# EasyEDA Pro project ProPrj_IoT House_2026-04-28.epro, board PCB3_2
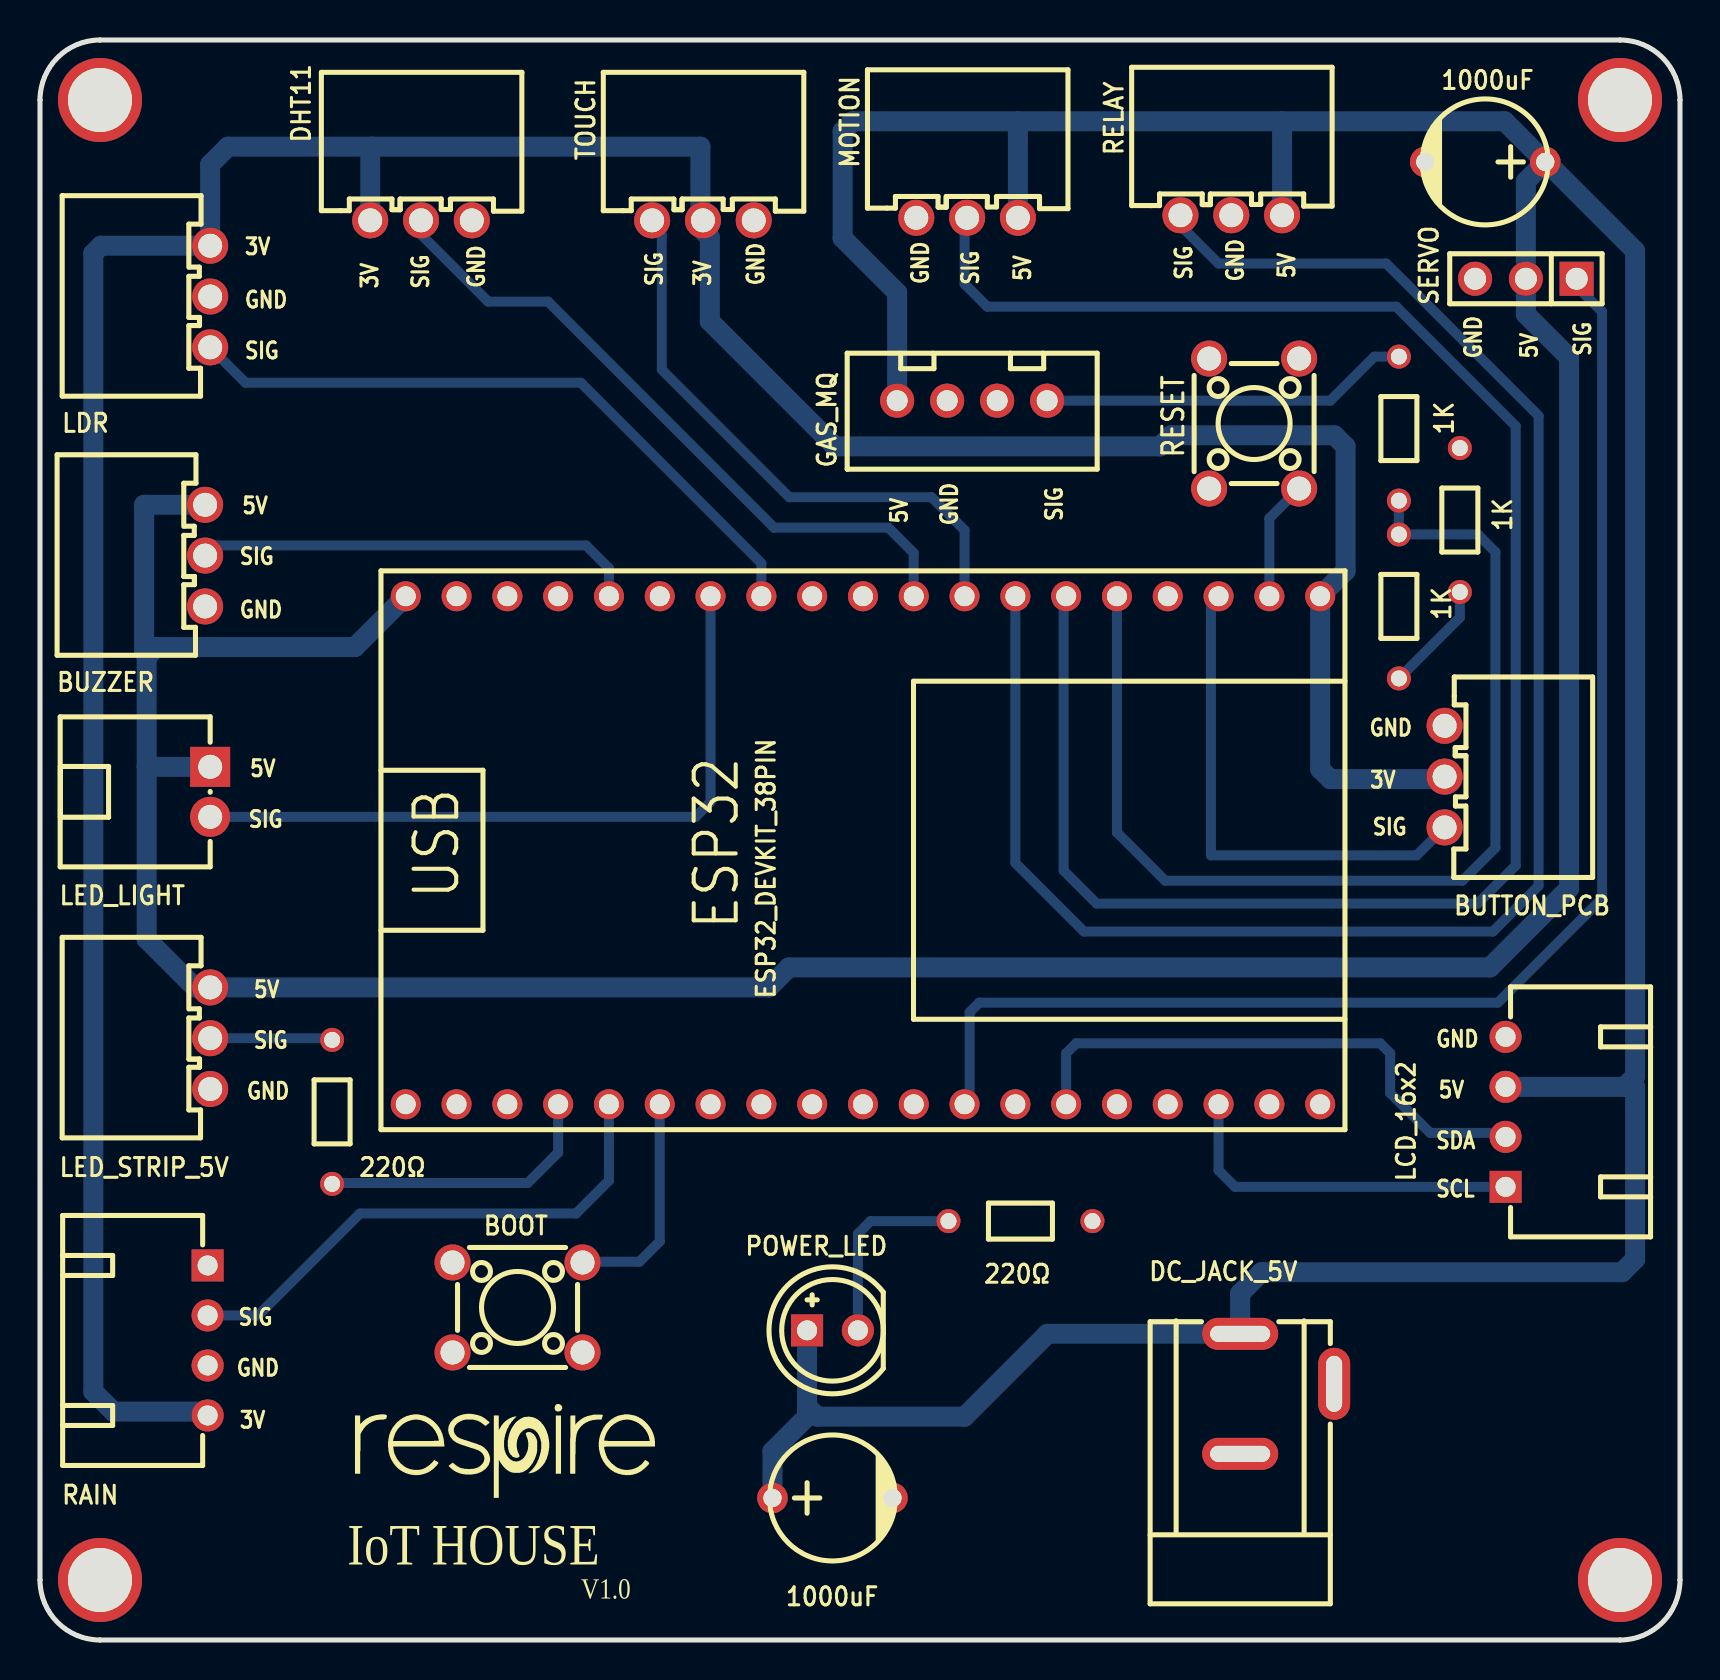
[diagram p9: board, top side]
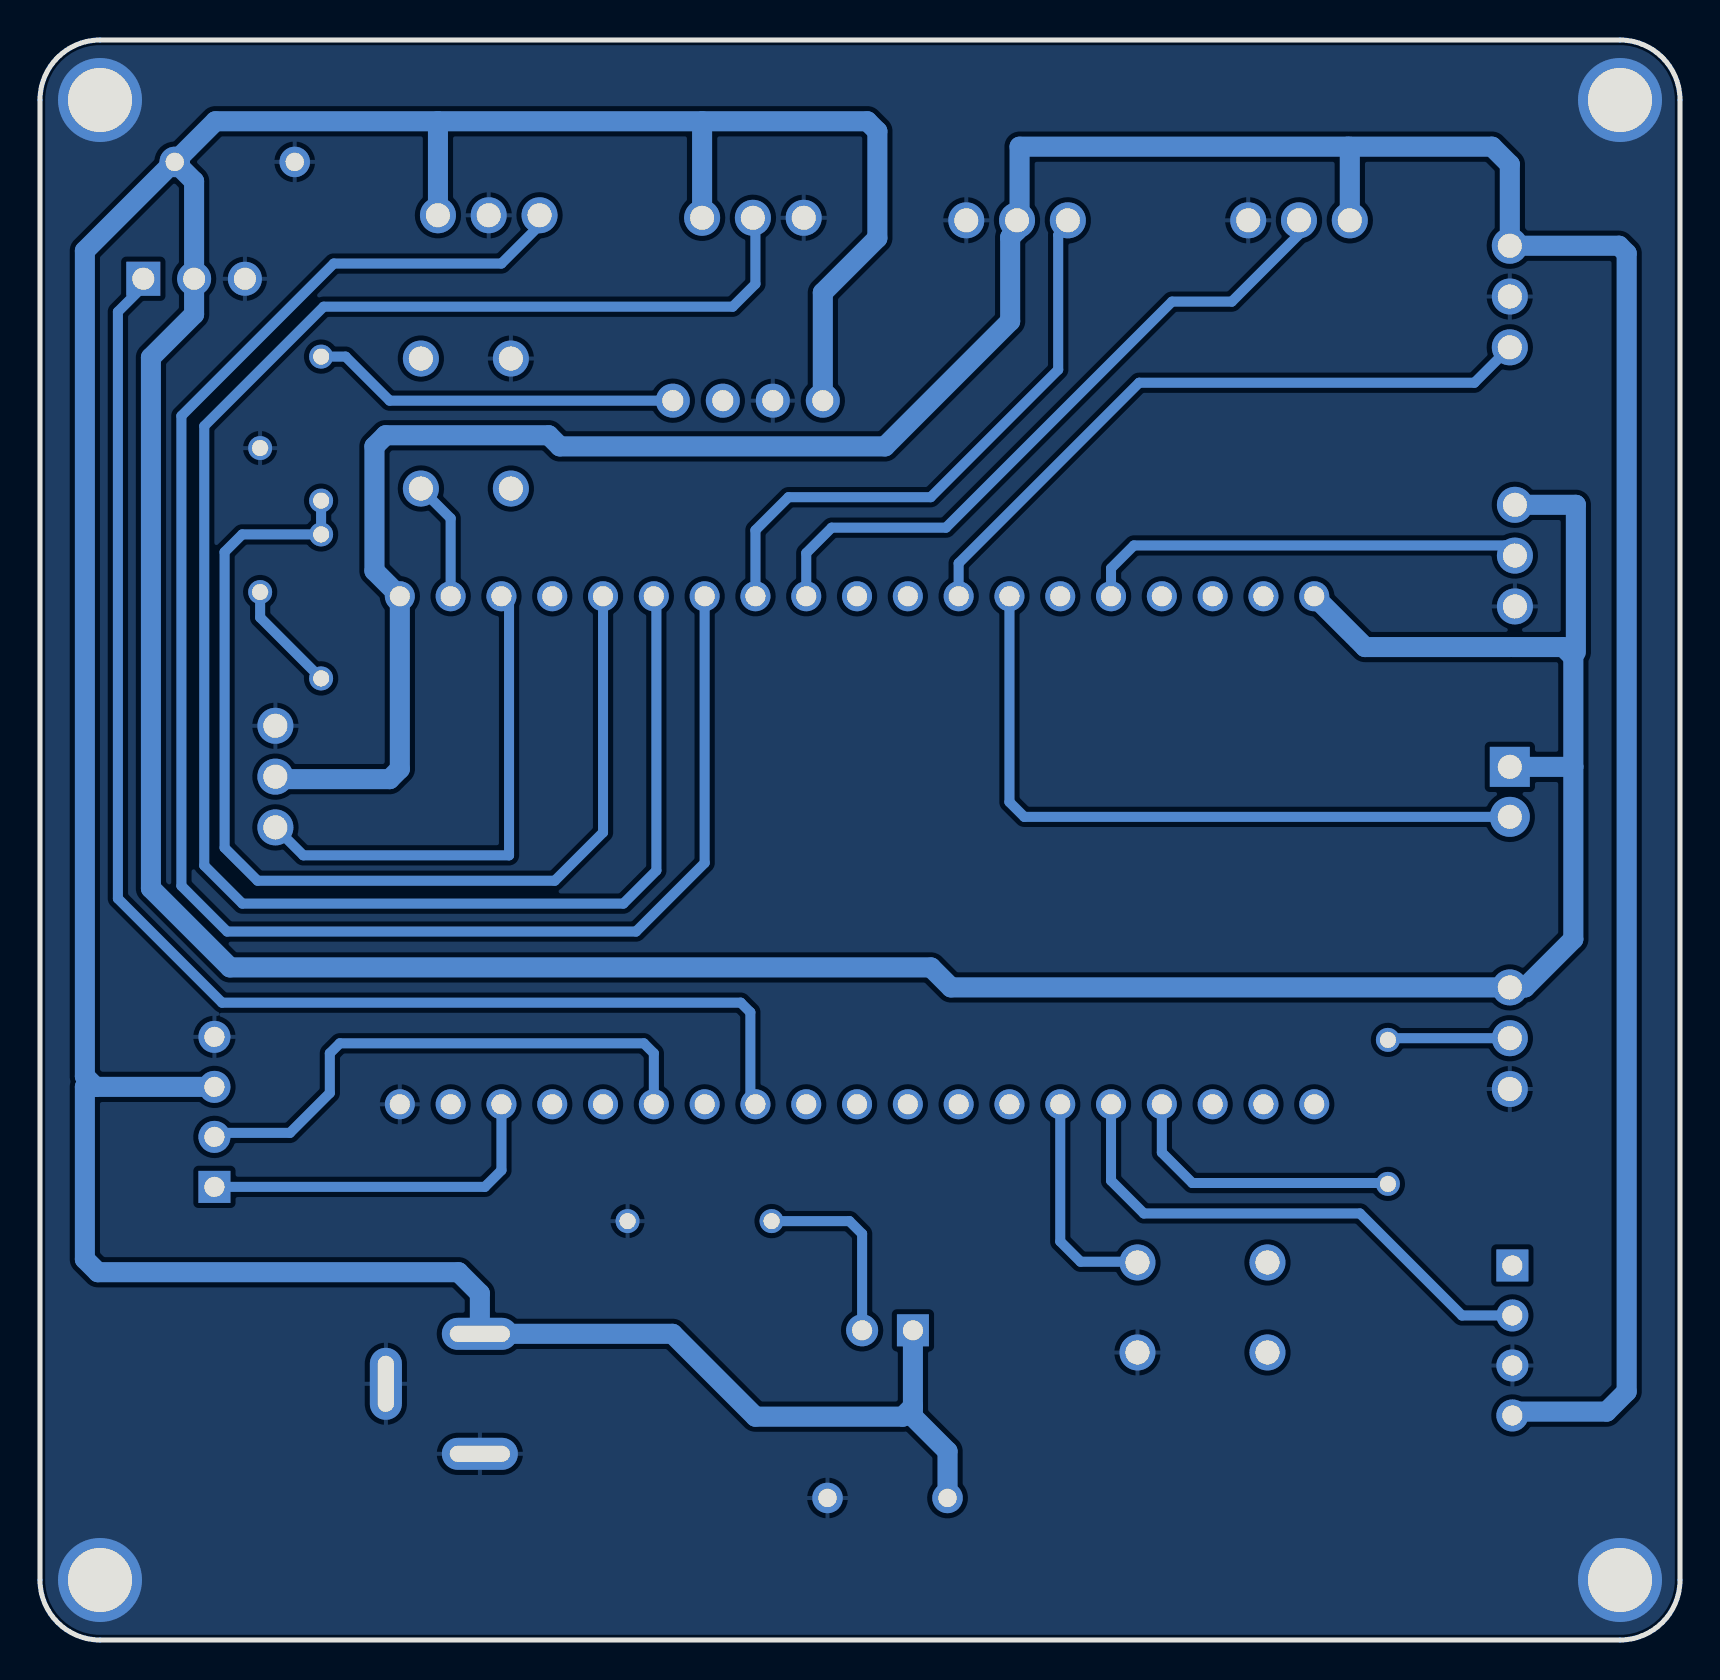
[diagram p10: board, bottom side, seen from below]

Outline 82 x 80 mm; copper layers: Top Layer, Bottom Layer. Coordinates in mm from the lower left corner of the outline.
Outline path: 0,77 0,3 arc(0.88,0.88) 3,0 79,0 arc(81.12,0.88) 82,3 82,77 arc(81.12,79.12) 79,80 3,80 arc(0.88,79.12) 0,77
Stack: Top Layer 0.035mm / Dielectric1 1.51mm FR4 er 4.5 / Bottom Layer 0.035mm

## Design rules (mm)
template: JLCPCB Capability(Two Layers Board)
spacing copperThickness1oz (default): track to track 0.102, other pairs 0.152 to 0.3
spacing copperThickness2oz: track to track 0.203, other pairs 0.152 to 0.3
track width copperThickness1oz (default): min 0.127, default 0.254, max 2.54
track width copperThickness2oz: min 0.203, default 0.254, max 2.54
differential pair differentialPair (default): width min 0.127, default 0.254, max 2.54; gap min 0.152, default 0.152
via viaSize (default): diameter min 0.5, default 0.61, max 10; hole min 0.3, default 0.305, max 6.3

## Placement (name value [footprint] x y rotation side)
1K  1K  [RES-TH_BD1.8-L3.2-P7.20-D0.4]  67.94 51.68 90 top
1K#2  -  [RES-TH_BD1.8-L3.2-P7.20-D0.4]  70.99 56 270 top
1K#3  -  [RES-TH_BD1.8-L3.2-P7.20-D0.4]  67.94 60.57 90 top
220Ω  220  [RES-TH_BD1.8-L3.2-P7.20-D0.4]  49.02 20.94 0 top
220Ω#2  -  [RES-TH_BD1.8-L3.2-P7.20-D0.4]  14.61 26.41 270 top
1000uF  470uF  [CAP-TH_BD6.3-P6.00-D0.8-FD]  39.62 7.1 0 top
1000uF#2  -  [CAP-TH_BD6.3-P6.00-D0.8-FD]  72.26 73.9 180 top
BOOT  AJ1-6*6_A  [SW-TH_4P-L6.0-W6.0-P4.50-LS6.5]  23.88 16.63 180 top
BUTTON_PCB  XH-3AW  [CONN-TH_3P-P2.54_HCTL_XH-3AW]  70.23 43.17 270 top
BUZZER  XH-3AW  [CONN-TH_3P-P2.54_HCTL_XH-3AW]  8.25 54.22 90 top
DC_JACK_5V  DC-005-5.5*2.1  [DC-IN-TH_DC-005-2]  62.36 12.31 90 top
DHT11  XH-3AW  [CONN-TH_3P-P2.54_HCTL_XH-3AW]  19.05 70.98 0 top
ESP32_DEVKIT_38PIN  ESP32-DevKitC  [BULETM-SMD_ESP32-DEVKITC]  41.15 39.49 180 top
GAS_MQ  XH-4A-2.54  [CONN-TH_4P-P2.50-XH2.54-4P]  46.61 61.97 0 top
LCD_16x2  XH-4AW  [CONN-TH_4P-P2.50_XH-4AW]  73.28 26.41 270 top
LDR  XH-3AW  [CONN-TH_3P-P2.54_HCTL_XH-3AW]  8.51 67.17 90 top
LED_LIGHT  XH-2AW  [CONN-TH_XH-2AW_C722860]  8.51 42.41 270 top
LED_STRIP_5V  XH-3AW  [CONN-TH_3P-P2.54_HCTL_XH-3AW]  8.51 30.09 90 top
MOTION  XH-3AW  [CONN-TH_3P-P2.54_HCTL_XH-3AW]  46.35 71.11 0 top
NOREF  -  [Pad_e903]  3 77 0 top
NOREF#2  -  [Pad_e625]  79 3 0 top
NOREF#3  -  [Pad_e978]  3 3 0 top
NOREF#4  -  [Pad_e831]  79 77 0 top
POWER_LED  -  [LED-TH_BD5.8-P2.54-FD]  39.62 15.48 0 top
RAIN  XH-4AW  [CONN-TH_4P-P2.50_XH-4AW]  8.38 14.98 90 top
RELAY  XH-3AW  [CONN-TH_3P-P2.54_HCTL_XH-3AW]  59.56 71.24 0 top
RESET  AJ1-6*6_A  [SW-TH_4P-L6.0-W6.0-P4.50-LS6.5]  60.71 60.82 90 top
SERVO  -  [HDR-TH_3P-P2.54-V-M]  74.29 68.06 180 top
TOUCH  XH-3AW  [CONN-TH_3P-P2.54_HCTL_XH-3AW]  33.15 70.98 0 top

## Footprints (pads in the part's own frame, mm; a bottom-side part is the same pattern mirrored in y, then rotated)
BULETM-SMD_ESP32-DEVKITC
  round 1.5 hole 1: 1(-22.86,-12.7) 2(-20.32,-12.7) 3(-17.78,-12.7) 4(-15.24,-12.7) 5(-12.7,-12.7) 6(-10.16,-12.7) 7(-7.62,-12.7) 8(-5.08,-12.7) 9(-2.54,-12.7) 10(0,-12.7) 11(2.54,-12.7) 12(5.08,-12.7) 13(7.62,-12.7) 14(10.16,-12.7) 15(12.7,-12.7) 16(15.24,-12.7) 17(17.78,-12.7) 18(20.32,-12.7) 19(22.86,-12.7) 20(-22.86,12.7) 21(-20.32,12.7) 22(-17.78,12.7) 23(-15.24,12.7) 24(-12.7,12.7) 25(-10.16,12.7) 26(-7.62,12.7) 27(-5.08,12.7) 28(-2.54,12.7) 29(0,12.7) 30(2.54,12.7) 31(5.08,12.7) 32(7.62,12.7) 33(10.16,12.7) 34(12.7,12.7) 35(15.24,12.7) 36(17.78,12.7) 37(20.32,12.7) 38(22.86,12.7)
CAP-TH_BD6.3-P6.00-D0.8-FD
  round 1.524 hole 0.914: 1(-3,0) 2(3,0)
CONN-TH_3P-P2.54_HCTL_XH-3AW
  round 1.8 hole 1.199: 1(-2.54,0) 2(0.002,0) 3(2.54,0)
CONN-TH_4P-P2.50-XH2.54-4P
  round 1.7 hole 1.05: 1(3.75,0) 2(1.25,0) 3(-1.25,0) 4(-3.75,0)
CONN-TH_4P-P2.50_XH-4AW
  rect 1.6x1.6 hole 1: 1(3.75,0)
  round 1.6 hole 1: 2(1.25,0) 3(-1.25,0) 4(-3.75,0)
CONN-TH_XH-2AW_C722860
  rect 2x2 hole 1.2: 1(-1.25,0)
  round 2 hole 1.2: 2(1.25,0)
DC-IN-TH_DC-005-2
  oval 1.6x3.8 hole 0.8x3: 1(2.999,2.35) 2(-3,2.35)
  oval 3.6x1.6 hole 2.8x0.8: 3(0.5,-2.35)
HDR-TH_3P-P2.54-V-M
  rect 1.7x1.7 hole 1.1: 1(-2.54,0)
  round 1.7 hole 1.1: 2(0,0) 3(2.54,0)
LED-TH_BD5.8-P2.54-FD
  rect 1.6x1.6 hole 1: 1(-1.27,0)
  round 1.6 hole 1: 2(1.27,0)
Pad_e625
  round 4.2 hole 3.2: 1(0,0)
Pad_e831
  round 4.2 hole 3.2: 1(0,0)
Pad_e903
  round 4.2 hole 3.2: 1(0,0)
Pad_e978
  round 4.2 hole 3.2: 1(0,0)
RES-TH_BD1.8-L3.2-P7.20-D0.4
  round 1.2 hole 0.8: 1(-3.6,0) 2(3.6,0)
SW-TH_4P-L6.0-W6.0-P4.50-LS6.5
  round 1.8 hole 1.2: 1(-3.25,2.25) 2(3.25,2.25) 3(-3.25,-2.25) 4(3.25,-2.25)

## Nets
3V: BUTTON_PCB.2 DHT11.1 ESP32_DEVKIT_38PIN.1 LDR.3 RAIN.4 TOUCH.2
5V: 1000uF.1 1000uF#2.1 BUZZER.3 DC_JACK_5V.1 ESP32_DEVKIT_38PIN.19 GAS_MQ.4 LCD_16x2.3 LED_LIGHT.1 LED_STRIP_5V.3 MOTION.3 POWER_LED.1 RELAY.3 SERVO.2
GND: 1K#2.1 220Ω.2 1000uF.2 1000uF#2.2 BOOT.1 BUTTON_PCB.1 BUZZER.1 DC_JACK_5V.2 DC_JACK_5V.3 DHT11.3 ESP32_DEVKIT_38PIN.20 GAS_MQ.3 LCD_16x2.4 LDR.2 LED_STRIP_5V.1 MOTION.1 NOREF.1 NOREF#2.1 NOREF#3.1 NOREF#4.1 RAIN.3 RELAY.2 RESET.2 SERVO.3 TOUCH.3
$1N4087: 220Ω.1 POWER_LED.2
$1N5542: ESP32_DEVKIT_38PIN.7 RELAY.1
$1N5549: ESP32_DEVKIT_38PIN.8 TOUCH.1
$1N5561: ESP32_DEVKIT_38PIN.6 MOTION.2
$1N5570: ESP32_DEVKIT_38PIN.12 LDR.1
$1N5623: ESP32_DEVKIT_38PIN.25 LCD_16x2.2
$1N5633: ESP32_DEVKIT_38PIN.22 LCD_16x2.1
$1N6222: ESP32_DEVKIT_38PIN.2 RESET.3
$1N8401: ESP32_DEVKIT_38PIN.34 RAIN.2
$1N8544: DHT11.2 ESP32_DEVKIT_38PIN.9
$1N8552: 220Ω#2.2 ESP32_DEVKIT_38PIN.35
$1N8560: ESP32_DEVKIT_38PIN.13 LED_LIGHT.2
$1N10988: 1K.2 1K#3.1 ESP32_DEVKIT_38PIN.5
$1N11077: BOOT.3 ESP32_DEVKIT_38PIN.33
$1N11755: 220Ω#2.1 LED_STRIP_5V.2
$1N11830: 1K.1 1K#2.2
$1N11849: 1K#3.2 GAS_MQ.1
$1N11911: ESP32_DEVKIT_38PIN.27 SERVO.1
$1N13992: BUZZER.2 ESP32_DEVKIT_38PIN.15
$1N14782: BUTTON_PCB.3 ESP32_DEVKIT_38PIN.3

Pads without a net: BOOT 2 4; ESP32_DEVKIT_38PIN 4 10 11 14 16 17 18 21 23 24 26 28 29 30 31 32 36 37 38; GAS_MQ 2; RAIN 1; RESET 1 4

## Routing (per net, layer and track width the routed paths; a pad name or vN(x,y) marks a point on that pad's centre or on a via; arc(x,y) is an arc through that point)
3V: length 168.7
  Bottom Layer w1: 16.51,74.54 16.64,74.67 33.02,74.67 33.02,71.11 TOUCH.2 33.15,70.47 33.49,70.13 33.49,65.94 39.75,59.68 56.01,59.68 56.56,60.24 64.72,60.24 65.28,59.68 65.28,53.46 ESP32_DEVKIT_38PIN.1 64.01,43.55 64.52,43.04 70.11,43.04 BUTTON_PCB.2 ; 16.51,74.54 DHT11.1 ; 16.51,74.54 16.51,74.67 9.4,74.67 8.51,73.78 8.51,69.71 3.05,69.71 2.67,69.33 2.67,12.42 3.67,11.42 8.19,11.42 RAIN.4
5V: length 332.5
  Bottom Layer w1: 5.33,43.66 5.33,35.04 7.75,32.63 36.45,32.63 37.45,33.63 72.5,33.63 76.45,37.58 76.45,64.12 74.29,66.28 SERVO.2 74.29,72.94 1000uF#2.1 ; 5.33,43.66 5.33,49.15 5.83,49.65 8.38,49.65 ; 5.33,43.66 LED_LIGHT.1 ; 1000uF#2.1 73.23,75.94 62.1,75.94 ; 1000uF#2.1 75.31,73.9 79.76,69.46 79.76,28.18 79.23,27.66 ; 38.35,11.67 38.35,11.17 36.62,9.44 1000uF.1 ; 38.35,11.67 38.86,11.17 46.23,11.17 50.37,15.31 DC_JACK_5V.1 60.01,17.32 61.07,18.39 79.1,18.39 79.76,19.04 79.76,27.66 79.23,27.66 ; 38.35,11.67 POWER_LED.1 ; 62.1,75.94 62.1,71.24 ; 62.1,75.94 48.9,75.94 ; GAS_MQ.4 42.86,67.37 40.13,70.09 40.13,75.44 40.63,75.94 48.9,75.94 ; 79.23,27.66 LCD_16x2.3 ; 48.9,71.11 48.9,75.94 ; 8.51,49.65 15.75,49.65 ESP32_DEVKIT_38PIN.19 ; 5.21,49.39 5.21,56.76 BUZZER.3
$1N4087: length 9.6
  Bottom Layer w0.5: 220Ω.1 41.53,20.94 40.89,20.31 POWER_LED.2
$1N5542: length 87.7
  Bottom Layer w0.5: ESP32_DEVKIT_38PIN.7 48.77,38.85 52.2,35.42 72.64,35.42 74.93,37.71 74.93,61.2 67.31,68.82 58.93,68.82 57.02,70.73 RELAY.1
$1N5549: length 29.4
  Bottom Layer w0.5: TOUCH.1 30.61,70.73 31.09,70.25 31.09,63.52 37.47,57.14 44.58,57.14 46.23,55.49 ESP32_DEVKIT_38PIN.8
$1N5561: length 93.7
  Bottom Layer w0.5: ESP32_DEVKIT_38PIN.6 51.18,52.06 51.18,38.47 52.83,36.82 71.88,36.82 73.79,38.72 73.79,60.7 67.82,66.67 47.36,66.67 46.23,67.8 46.23,70.98 MOTION.2
$1N5570: length 33.7
  Bottom Layer w0.5: LDR.1 10.28,62.86 27.04,62.86 36.07,53.84 ESP32_DEVKIT_38PIN.12
$1N5623: length 27.8
  Bottom Layer w0.5: 51.31,26.79 51.31,29.33 51.81,29.83 67.01,29.83 67.51,29.33 67.51,27.35 69.5,25.36 73.08,25.36 LCD_16x2.2
$1N5633: length 18
  Bottom Layer w0.5: LCD_16x2.1 59.76,22.66 58.93,23.48 58.93,26.79
$1N6222: length 6
  Bottom Layer w0.5: RESET.3 61.47,56.08 ESP32_DEVKIT_38PIN.2
$1N8401: length 26.7
  Bottom Layer w0.5: 28.45,26.79 28.45,22.97 26.81,21.33 16,21.33 10.9,16.23 RAIN.2
$1N8544: length 34.1
  Bottom Layer w0.5: ESP32_DEVKIT_38PIN.9 43.69,54.35 42.42,55.62 36.7,55.62 25.4,66.92 22.41,66.92 19.05,70.28 DHT11.2
$1N8552: length 14.4
  Bottom Layer w0.5: 220Ω#2.2 14.65,22.85 24.38,22.85 25.91,24.37 25.91,26.79
$1N8560: length 35.6
  Bottom Layer w0.5: ESP32_DEVKIT_38PIN.13 33.53,41.9 32.79,41.16 LED_LIGHT.2
$1N10988: length 54.1
  Bottom Layer w0.5: 67.94,56.97 1K.2 71.89,55.28 72.77,54.4 72.77,39.61 71.12,37.96 56.26,37.96 53.85,40.38 ESP32_DEVKIT_38PIN.5
$1N11077: length 10.4
  Bottom Layer w0.5: 30.99,26.79 30.99,19.93 29.97,18.91 27.85,18.91
$1N11755: length 6.1
  Bottom Layer w0.5: LED_STRIP_5V.2 14.52,30.09 220Ω#2.1
$1N11830: length 5.6
  Bottom Layer w0.5: 1K.1 70.99,51.13 1K#2.2
$1N11849: length 18.5
  Bottom Layer w0.5: GAS_MQ.1 64.52,61.97 66.72,64.17 1K#3.2
$1N11911: length 70.2
  Bottom Layer w0.5: 46.23,26.79 46.48,27.04 46.48,31.39 46.96,31.87 72.9,31.87 78.1,37.07 78.1,66.41 76.84,67.68 76.84,68.06
$1N13992: length 22.1
  Bottom Layer w0.5: 8.38,54.35 8.76,54.73 27.31,54.73 28.45,53.58 ESP32_DEVKIT_38PIN.15
$1N14782: length 25.4
  Bottom Layer w0.5: BUTTON_PCB.3 68.83,39.23 58.55,39.23 58.55,51.81 ESP32_DEVKIT_38PIN.3

## Copper pours and planes (outline as drawn; the poured copper is in the pictures)
GND on Bottom Layer: 0,80 82.17,80 82.17,-0.14 0,-0.14

## Text on the board
Top Silkscreen Layer: GND | 3V | 5V | SIG | SDA | SCL | RESET | ESP32 | USB | V1.0 | IoT HOUSE
